# Altium schematic sheet High Side Driver.SchDoc: High Side Driver
size A4; DrawnBy: DJW; SheetNumber: 9; SheetTotal: 9
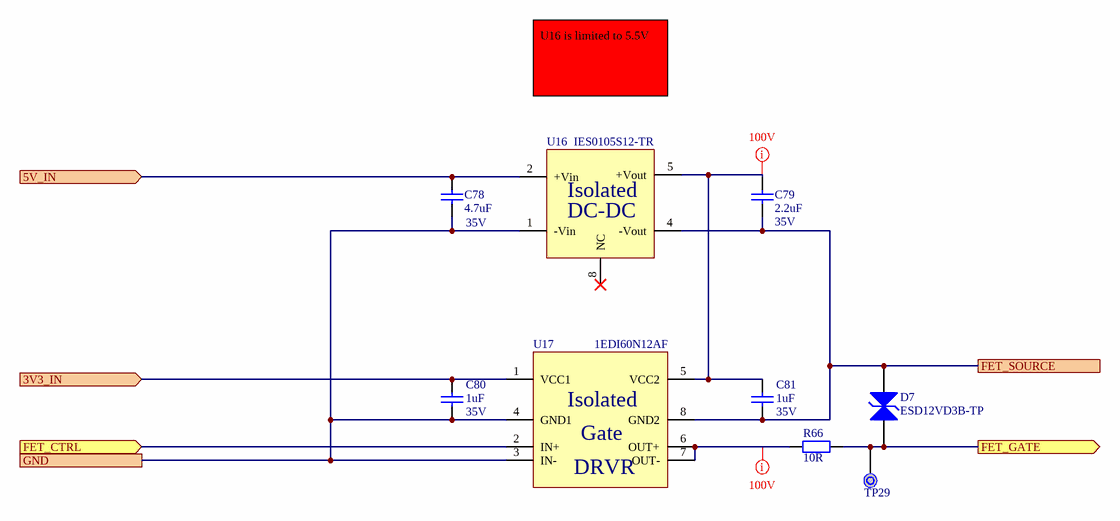
[diagram p0: High Side Driver.SchDoc]

## Parts
C78  4.7uF  Voltage: 35V  [0805 CAP]
C79  2.2uF  Voltage: 35V  [0603 CAP]
C80  1uF  Voltage: 35V  [0603 CAP]
C81  1uF  Voltage: 35V  [0603 CAP]
D7  ESD12VD3B-TP  [SOD323]
R66  10R  [0603 RES]
TP29  Testpoint SMD  [Testpoint - SMD]  (value not drawn)  (no BOM)
U16  IES0105S12-TR  [SMD8]
U17  1EDI60N12AF  [SOIC127-8]

## Ports
3V3_IN (in), 5V_IN (in), FET_CTRL (in), FET_GATE (out), FET_SOURCE, GND

## Nets
3V3_IN: C80.2 U17.1(VCC1) ; port 3V3_IN
5V_IN: C78.2 U16.2(+Vin) ; port 5V_IN
FET_CTRL: U17.2(IN+) ; port FET_CTRL
FET_GATE: D7.2(A) R66.1 TP29.1 ; port FET_GATE
FET_SOURCE: C79.2 C81.1 D7.1(K) U16.4(-Vout) U17.8(GND2) ; port FET_SOURCE
GND: C78.1 C80.1 U16.1(-Vin) U17.3(IN-) U17.4(GND1) ; port GND
NetC79_1: C79.1 C81.2 U16.5(+Vout) U17.5(VCC2)
NetR66_2: R66.2 U17.6(OUT+) U17.7(OUT-)

Not connected (* = marked no-connect by the designer): U16 8(NC)*

## Layout directives
net class 100V: NetC79_1, NetR66_2

## Notes on the sheet
- U16 is limited to 5.5V
- Title:
- (C) 2021
- File:
- Part Number:
- Revision:
- Sheet:
- Date:
- Size:
- A4
- Drawn By:
- (in symbol 1EDI60N12AF) Isolated; Gate; DRVR
- (in symbol IES0105S12-TR) Isolated; DC-DC

## Library data of the parts
C78 = Capacitor 4.7uF 0805: Capacitor 4.7uF 0805 X7R 35V 10%; Value: 4.7uF; Supplier 1: Digi-Key; Supplier Part Number 1: 445-172479-1-ND; Supplier 2: Digi-Key; Supplier 3: Digi-Key; Supplier Part Number 2: 1276-6722-1-ND; Supplier Part Number 3: 490-12361-1-ND; Supplier 4: Digi-Key; Supplier Part Number 4: 445-7555-1-ND
C79 = Capacitor 2.2uF 0603 35V: Capacitor 2.2uF 0603 X5R 35V 10%; Mass_g: 0.0081; Value: 2.2uF; Voltage Rating: 35V; Supplier 1: Digi-Key; Supplier Part Number 1: 490-7204-1-ND; Supplier 2: Digi-Key; Supplier Part Number 2: 1276-6726-1-ND
C80 C81 = Capacitor 1uF 0603: Capacitor 1uF 0603 X7R 35V 10%; Mass_g: 0.0081; Value: 1uF; Supplier 1: Digi-Key; Supplier Part Number 1: 445-173625-1-ND; Supplier 2: Digi-Key; Supplier Part Number 2: 587-4356-1-ND; Supplier 3: Digi-Key; Supplier Part Number 3: 445-174215-1-ND; Supplier 4: Digi-Key; Supplier Part Number 4: 445-C1608X7R1V105M080ACCT-ND; Supplier 5: Mouser; Supplier Part Number 5: 810-C1608X7R1V105MAC
D7 = ESD12VD3B-TP: Diode 12V TVS; Supplier 1: Digi-Key; Supplier Part Number 1: ESD12VD3B-TPMSCT-ND; Supplier 2: Digi-Key; Supplier Part Number 2: SD12T1GOSCT-ND
R66 = Resistor 10R 0603: Resistor 10R 0603 0.1W 1%; Mass_g: 0.002; Revision: Altium ETH 11-03.2008; Value: 10R; Supplier 1: Digi-Key; Supplier Part Number 1: P10.0HCT-ND; Supplier 2: Digi-Key; Supplier Part Number 2: 311-10.0HRCT-ND; Supplier 3: Digi-Key; Supplier Part Number 3: RMCF0603FT10R0CT-ND
U16 = IES0105S12-TR: Isolated DC/DC Converters DC-DC, 1W; MP: HCPL2630S; Package: None; Price: None; Value: *; Availability: Unavailable; Supplier 1: Digi-Key; Supplier Part Number 1: 1470-IES0105S12-CT-ND; Supplier 2: Mouser; Supplier Part Number 2: 209-IES0105S12-TR
U17 = 1EDI60N12AF: Isolated Gate Driver; Manufacturer_Name: Infineon; Datasheet Link: https://componentsearchengine.com//1EDI60N12AF.pdf; Height: 1.75mm; Mouser2 Part Number: 726-1EDI60N12AF; Mouser2 Price/Stock: https://www.mouser.com/Search/Refine.aspx?Keyword=726-1EDI60N12AF; Manufacturer_Part_Number: 1EDI60N12AF; Supplier 1: RSComponents; Supplier Part Number 1: 1339885; Supplier 2: Mouser; Supplier Part Number 2: 726-1EDI60N12AF